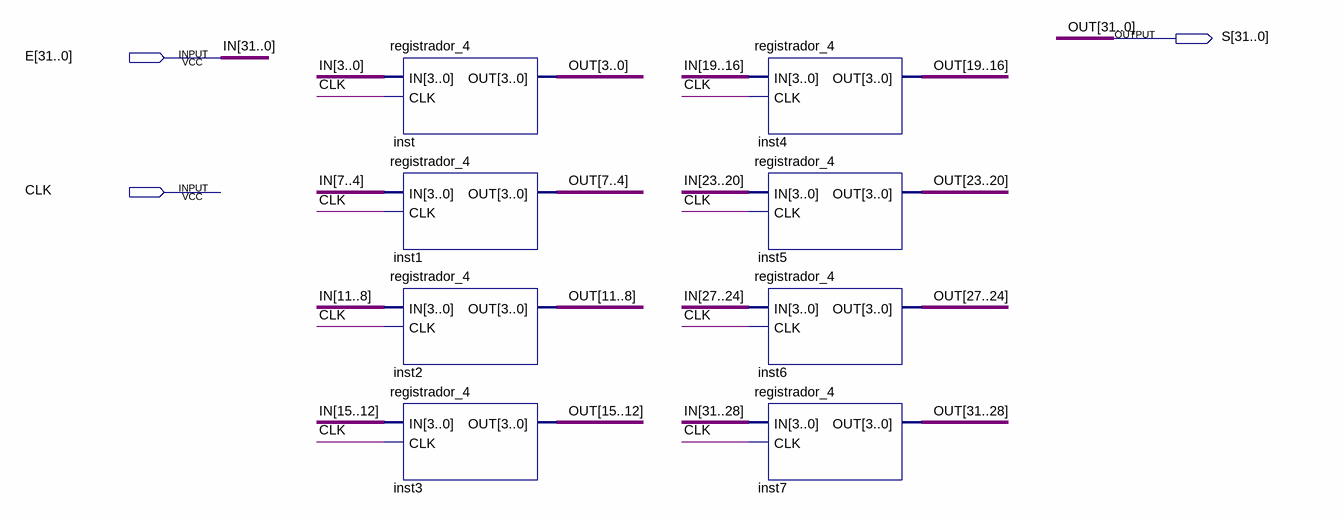
[diagram p0: schematic sheet]
// Quartus schematic registrador_32.bdf as structural Verilog: 8 symbols, 3 pins
module registrador_32 (
  input  [31:0] E,
  input  CLK,
  output [31:0] S
);

  registrador_4 inst (.IN(E[3:0]), .CLK(CLK), .OUT(S[3:0]));
  registrador_4 inst1 (.IN(E[7:4]), .CLK(CLK), .OUT(S[7:4]));
  registrador_4 inst2 (.IN(E[11:8]), .CLK(CLK), .OUT(S[11:8]));
  registrador_4 inst3 (.IN(E[15:12]), .CLK(CLK), .OUT(S[15:12]));
  registrador_4 inst4 (.IN(E[19:16]), .CLK(CLK), .OUT(S[19:16]));
  registrador_4 inst5 (.IN(E[23:20]), .CLK(CLK), .OUT(S[23:20]));
  registrador_4 inst6 (.IN(E[27:24]), .CLK(CLK), .OUT(S[27:24]));
  registrador_4 inst7 (.IN(E[31:28]), .CLK(CLK), .OUT(S[31:28]));

  // Other names for the same wires on the sheet: IN[31:0] = E; OUT[31:0] = S
endmodule
